# Altium schematic sheet LDO.SchDoc
size B; Organization: Altium Limited; Address1: L3, 12a Rodborough Rd; Address2: Frenchs Forest; Address3: NSW; Address4: Australia 2086
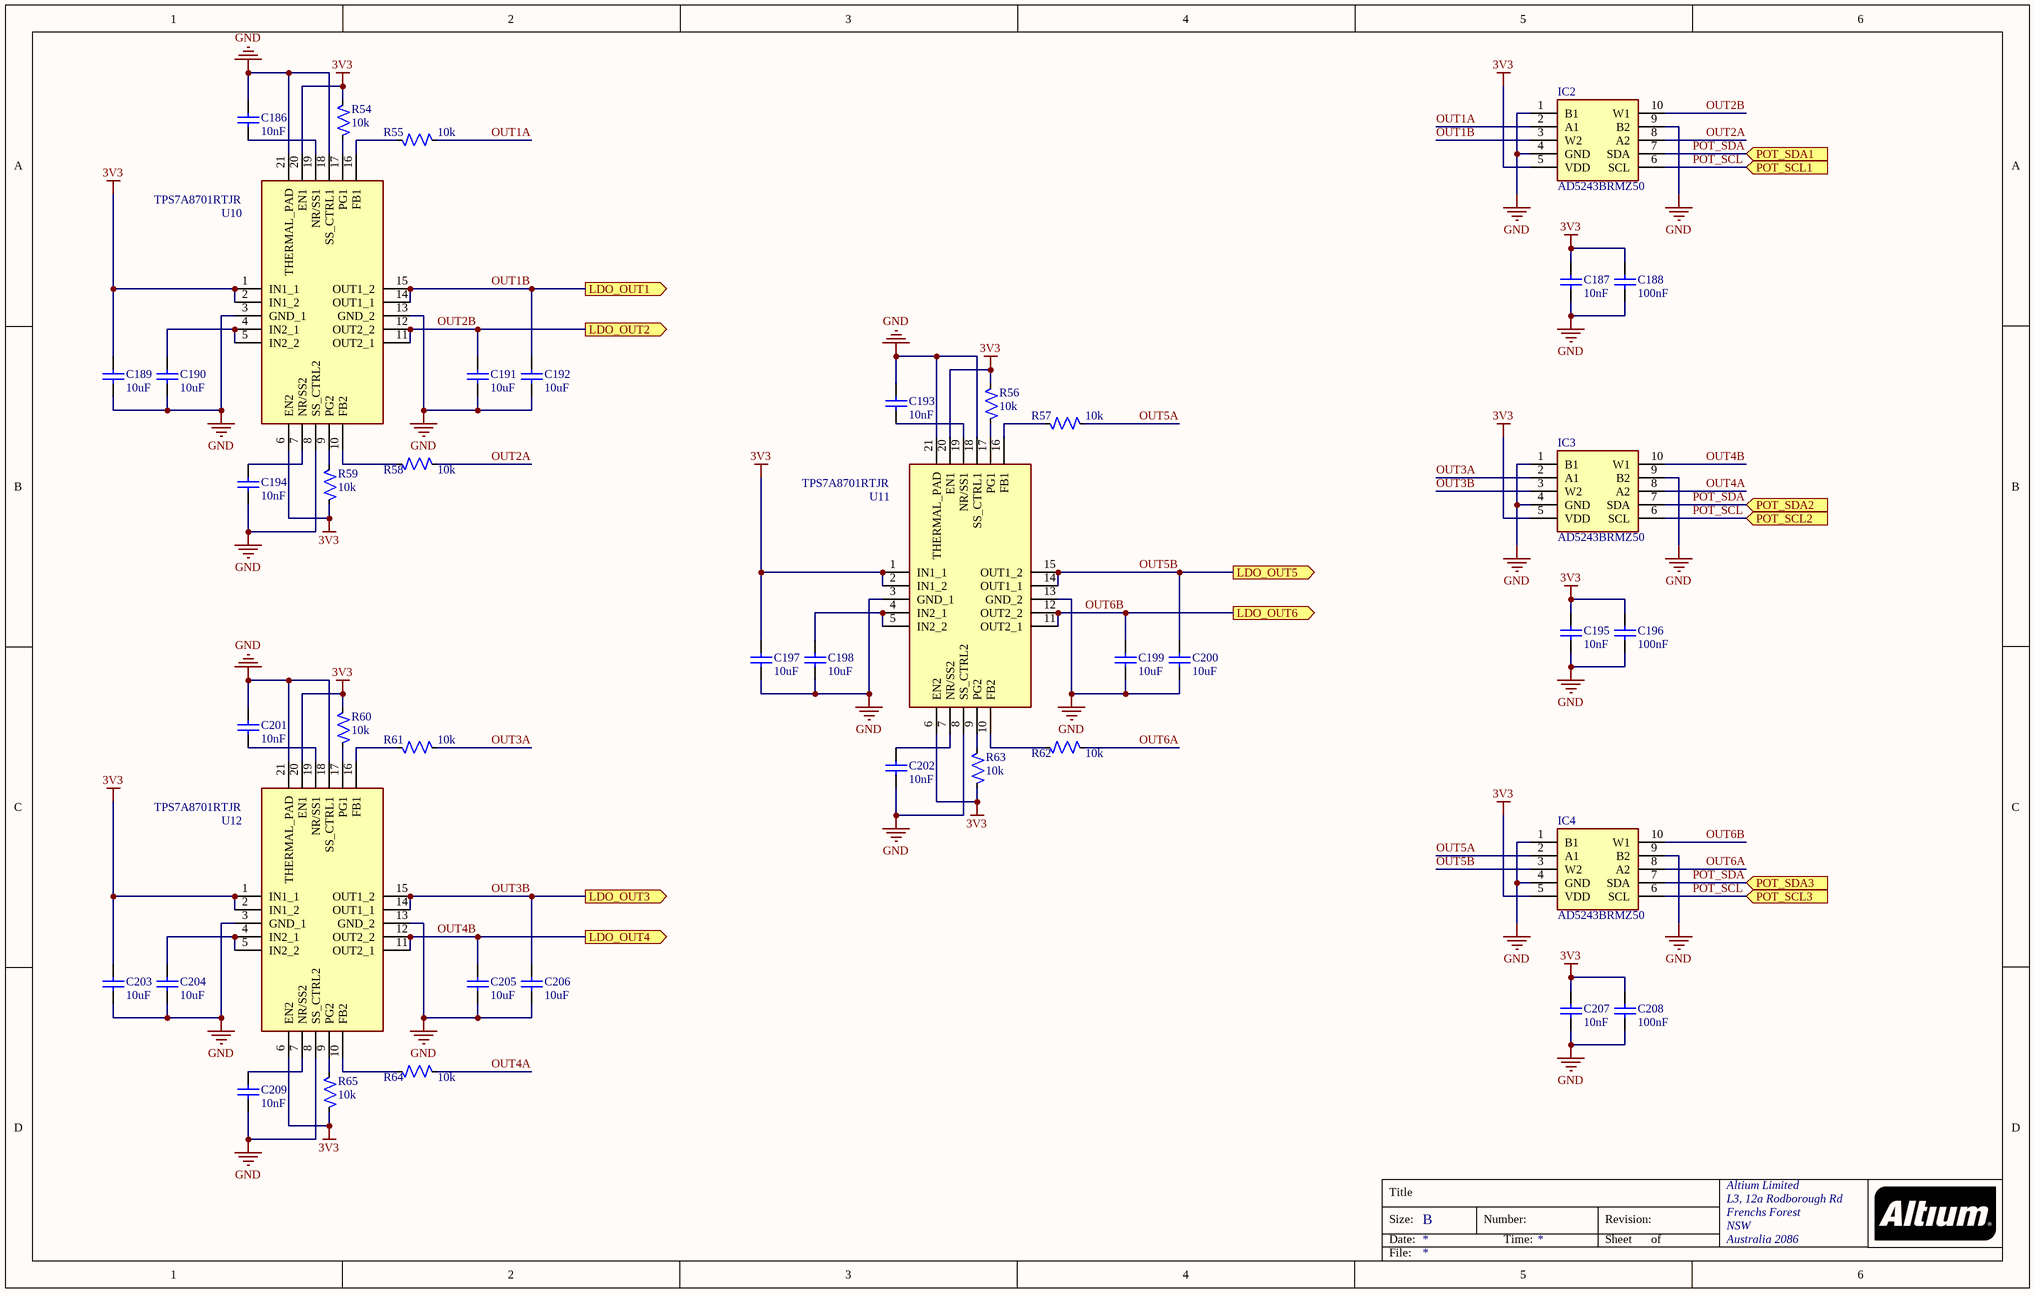
[diagram p0: LDO.SchDoc]

## Parts
C186  10nF  [CAPC0402(1005)60_N]
C187  10nF  [CAPC0402(1005)60_N]
C188  100nF  [CAPC0402(1005)60_N]
C189  10uF  [CAPC0805(2012)145_N]
C190  10uF  [CAPC0805(2012)145_N]
C191  10uF  [CAPC0805(2012)145_N]
C192  10uF  [CAPC0805(2012)145_N]
C193  10nF  [CAPC0402(1005)60_N]
C194  10nF  [CAPC0402(1005)60_N]
C195  10nF  [CAPC0402(1005)60_N]
C196  100nF  [CAPC0402(1005)60_N]
C197  10uF  [CAPC0805(2012)145_N]
C198  10uF  [CAPC0805(2012)145_N]
C199  10uF  [CAPC0805(2012)145_N]
C200  10uF  [CAPC0805(2012)145_N]
C201  10nF  [CAPC0402(1005)60_N]
C202  10nF  [CAPC0402(1005)60_N]
C203  10uF  [CAPC0805(2012)145_N]
C204  10uF  [CAPC0805(2012)145_N]
C205  10uF  [CAPC0805(2012)145_N]
C206  10uF  [CAPC0805(2012)145_N]
C207  10nF  [CAPC0402(1005)60_N]
C208  100nF  [CAPC0402(1005)60_N]
C209  10nF  [CAPC0402(1005)60_N]
IC2  AD5243BRMZ50  [SOP50P490X110-10N]
IC3  AD5243BRMZ50  [SOP50P490X110-10N]
IC4  AD5243BRMZ50  [SOP50P490X110-10N]
R54  10k  [RESC-0603]
R55  10k  [RESC-0603]
R56  10k  [RESC-0603]
R57  10k  [RESC-0603]
R58  10k  [RESC-0603]
R59  10k  [RESC-0603]
R60  10k  [RESC-0603]
R61  10k  [RESC-0603]
R62  10k  [RESC-0603]
R63  10k  [RESC-0603]
R64  10k  [RESC-0603]
R65  10k  [RESC-0603]
U10  TPS7A8701RTJR  [QFN50P400X400X80-21N-D]
U11  TPS7A8701RTJR  [QFN50P400X400X80-21N-D]
U12  TPS7A8701RTJR  [QFN50P400X400X80-21N-D]

## Ports
LDO_OUT1 (out), LDO_OUT2 (out), LDO_OUT3 (out), LDO_OUT4 (out), LDO_OUT5 (out), LDO_OUT6 (out), POT_SCL1 (in), POT_SCL2 (in), POT_SCL3 (in), POT_SDA1 (in), POT_SDA2 (in), POT_SDA3 (in)

## Nets
3V3: C187.2 C188.2 C189.2 C195.2 C196.2 C197.2 C203.2 C207.2 C208.2 IC2.5(VDD) IC3.5(VDD) IC4.5(VDD) R54.2 R56.2 R59.1 R60.2 R63.1 R65.1 U10.1(IN1_1) U10.2(IN1_2) U10.6(EN2) U10.20(EN1) U11.1(IN1_1) U11.2(IN1_2) U11.6(EN2) U11.20(EN1) U12.1(IN1_1) U12.2(IN1_2) U12.6(EN2) U12.20(EN1)
GND: C186.2 C187.1 C188.1 C189.1 C190.1 C191.1 C192.1 C193.2 C194.1 C195.1 C196.1 C197.1 C198.1 C199.1 C200.1 C201.2 C202.1 C203.1 C204.1 C205.1 C206.1 C207.1 C208.1 C209.1 IC2.1(B1) IC2.4(GND) IC2.9(B2) IC3.1(B1) IC3.4(GND) IC3.9(B2) IC4.1(B1) IC4.4(GND) IC4.9(B2) U10.3(GND_1) U10.8(SS_CTRL2) U10.13(GND_2) U10.18(SS_CTRL1) U10.21(THERMAL_PAD) U11.3(GND_1) U11.8(SS_CTRL2) U11.13(GND_2) U11.18(SS_CTRL1) U11.21(THERMAL_PAD) U12.3(GND_1) U12.8(SS_CTRL2) U12.13(GND_2) U12.18(SS_CTRL1) U12.21(THERMAL_PAD)
OUT1A: IC2.2(A1) R55.1
OUT1B: C192.2 IC2.3(W2) U10.14(OUT1_1) U10.15(OUT1_2) ; port LDO_OUT1
OUT2A: IC2.8(A2) R58.1
OUT2B: C191.2 IC2.10(W1) U10.11(OUT2_1) U10.12(OUT2_2) ; port LDO_OUT2
OUT3A: IC3.2(A1) R61.1
OUT3B: C206.2 IC3.3(W2) U12.14(OUT1_1) U12.15(OUT1_2) ; port LDO_OUT3
OUT4A: IC3.8(A2) R64.1
OUT4B: C205.2 IC3.10(W1) U12.11(OUT2_1) U12.12(OUT2_2) ; port LDO_OUT4
OUT5A: IC4.2(A1) R57.1
OUT5B: C200.2 IC4.3(W2) U11.14(OUT1_1) U11.15(OUT1_2) ; port LDO_OUT5
OUT6A: IC4.8(A2) R62.1
OUT6B: C199.2 IC4.10(W1) U11.11(OUT2_1) U11.12(OUT2_2) ; port LDO_OUT6
POT_SCL: IC2.6(SCL) IC3.6(SCL) IC4.6(SCL) ; port POT_SCL1, port POT_SCL3, port POT_SCL2
POT_SDA: IC2.7(SDA) IC3.7(SDA) IC4.7(SDA) ; port POT_SDA1, port POT_SDA3, port POT_SDA2
NetC186_1: C186.1 U10.19(NR/SS1)
NetC190_2: C190.2 U10.4(IN2_1) U10.5(IN2_2)
NetC193_1: C193.1 U11.19(NR/SS1)
NetC194_2: C194.2 U10.7(NR/SS2)
NetC198_2: C198.2 U11.4(IN2_1) U11.5(IN2_2)
NetC201_1: C201.1 U12.19(NR/SS1)
NetC202_2: C202.2 U11.7(NR/SS2)
NetC204_2: C204.2 U12.4(IN2_1) U12.5(IN2_2)
NetC209_2: C209.2 U12.7(NR/SS2)
NetR54_1: R54.1 U10.17(PG1)
NetR55_2: R55.2 U10.16(FB1)
NetR56_1: R56.1 U11.17(PG1)
NetR57_2: R57.2 U11.16(FB1)
NetR58_2: R58.2 U10.10(FB2)
NetR59_2: R59.2 U10.9(PG2)
NetR60_1: R60.1 U12.17(PG1)
NetR61_2: R61.2 U12.16(FB1)
NetR62_2: R62.2 U11.10(FB2)
NetR63_2: R63.2 U11.9(PG2)
NetR64_2: R64.2 U12.10(FB2)
NetR65_2: R65.2 U12.9(PG2)

## Notes on the sheet
- Title
- Size:
- Date:
- B
- Number:
- Time:
- Revision:
- Sheet
- of
- File:

## Library data of the parts
C186-C188 C193-C196 C201 C202 C207-C209 = CAP_0402
C189-C192 C197-C200 C203-C206 = CAP_0805
IC2-IC4 = AD5243BRMZ50: Integrated Circuit; Manufacturer_Name: Analog Devices; Datasheet Link: http://docs-emea.rs-online.com/webdocs/0e38/0900766b80e38358.pdf; Height: 1.1mm; Manufacturer_Part_Number: AD5243BRMZ50; Mouser Part Number: 584-AD5243BRMZ50; Mouser Price/Stock: https://www.mouser.com/Search/Refine.aspx?Keyword=584-AD5243BRMZ50; RS Part Number: 9126564; RS Price/Stock: http://uk.rs-online.com/web/p/products/9126564
R54-R65 = RES_0603: Part_Type: Resistor; Mfr Part Number: RC0603FR-0710KL; Manufacturer: Yageo; Mfr Part Description: RES 10k Ohm ±1% 1/10W 0603 (1608 Metric); ID: 60146; Temperature Coeff: ±100ppm/°C; Tolerance: ±1%; Power_Rating: 0.1W,1/10W; Updated By: murbach; Sub_Type: ThkFlm; Value: 10k; Supplier 1: Digi-Key; Supplier Part Number 1: 311-10.0KHRCT-ND; Package_Case: 0603 (1608 Metric); RoHS: Yes; Temperature Range: -55C to +155C; Created By: murbach; LifeCycle: Released; ComponentLink1Description: Datasheets; ComponentLink1URL: http://www.yageo.com/documents/recent/PYu-RC0603_51_RoHS_L_4.pdf; ComponentLink2Description: Supplier Part Details; ComponentLink2URL: http://www.digikey.com/product-detail/en/RC0603FR-0710KL/311-10.0KHRCT-ND/729827; Created_Date: 2014/11/24 21:28:44; Updated_Date: 2018/06/05 14:35:44
U10-U12 = TPS7A8701RTJR: Integrated Circuit; Manufacturer_Name: Texas Instruments; Datasheet Link: http://www.ti.com/lit/gpn/tps7a87; Height: 0.8mm; Manufacturer_Part_Number: TPS7A8701RTJR; Mouser Part Number: 595-TPS7A8701RTJR; Mouser Price/Stock: https://www.mouser.com/Search/Refine.aspx?Keyword=595-TPS7A8701RTJR